# Altium schematic sheet PCM290x.SchDoc
size A4; SheetNumber: 2; SheetTotal: 3
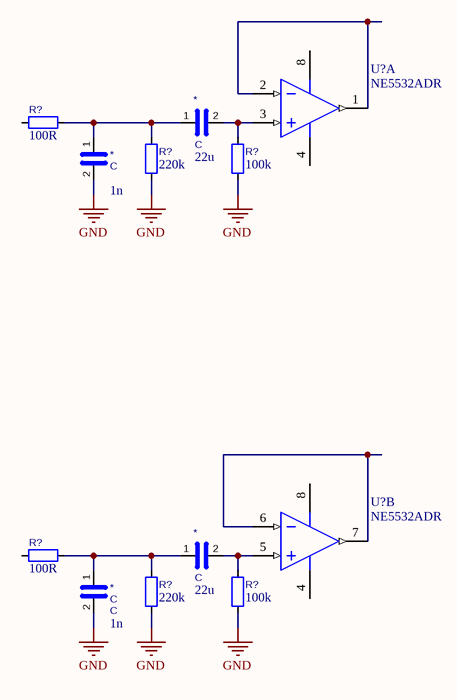
[diagram p0: PCM290x.SchDoc]

## Parts
(Parts that share a designator on the sheet are numbered #1, #2 ... from top to bottom, then left to right.)
*#1  22u
*#2  1n
*#3  22u
*#4  1n  value C
R?#1  100R
R?#2  220k
R?#3  100k
R?#4  100R
R?#5  220k
R?#6  100k
U?#1  NE5532ADR  [D0008A_M]  (part A of 2)
U?#2  NE5532ADR  [D0008A_M]  (part B of 2)

## Nets
GND: *#2.2 *#4.2 R?#2.2 R?#3.2 R?#5.2 R?#6.2
Net*#1_1: *#1.1 *#2.1 R?#1.2 R?#2.1
Net*#1_2: *#1.2 R?#3.1 U?#1.3(IN1+)
Net*#3_1: *#3.1 *#4.1 R?#4.2 R?#5.1
Net*#3_2: *#3.2 R?#6.1 U?#2.5(IN2+)
NetU?#1_1: U?#1.1(OUT1) U?#1.2(IN1-)
NetU?#2_6: U?#2.6(IN2-) U?#2.7(OUT2)

Not connected (* = marked no-connect by the designer): R?#1 1; R?#4 1; U?#1 4(VCC-) 8(VCC+); U?#2 4(VCC-) 8(VCC+)

## Library data of the parts
*#1-*#4 = C: Unpolarized capacitor; ki_keywords: cap capacitor; ki_fp_filters: C_*; Reference: C; Datasheet: ~; Description_: Unpolarized capacitor
  *#1 *#3: 22u: C
  *#2: 1n: C
R?#1-R?#6 = R: Resistor
U?#1 U?#2 = CMP-0017-00450-2: Dual Low-Noise Operational Amplifier, 10 to 30 V, 0 to 70 degC, 8-pin SOIC (D8), Green (RoHS & no Sb/Br); Manufacturer: Texas Instruments; Total Supply Voltage(Min)(+5V is 5, +/-5V is 10): 10; Slew Rate(Typ)(V/us): 9; Sub Family: General Purpose Amplifier, High Supply Voltage Amplifier (>=30V), Low Noise Amp (<=10nV/rtHz); Vio (25C)(Max)(mV): 4; IIB(Max)(pA): 800000; Vn at 1kHz(Typ)(nV/rtHz): 5; Number of Channels: 2; Total Supply Voltage(Max)(+5V is 5, +/-5V is 10): 30; CMRR(Min)(dB): 70; Code_JEDEC: MS-012; ComponentLink1URL: http://www.ti.com/; DatasheetVersion: SLOS075I; PackageDescription: 8-Pin Plastic Small Outline, Body 4.9 x 3.9 mm, Pitch 1.27 mm; Eco-Plan: Green (RoHS & no Sb/Br); ComponentLink3Description: Package Specification; PackageReference: D0008A; Mounting Technology: Surface Mount; GBW(Typ)(MHz): 10; ComponentLink2Description: Datasheet; ComponentLink1Description: Manufacturer URL; PartNumber: NE5532ADR; ComponentLink3URL: http://www.ti.com/litv/pdf/msoi002j; PackageVersion: 4040047-3/M, 06/2011; ComponentLink2URL: http://www.ti.com/lit/ds/symlink/ne5532a.pdf; Iq per channel(Max)(mA): 4